# EAGLE design Programmer (EAGLE 7.3.0)
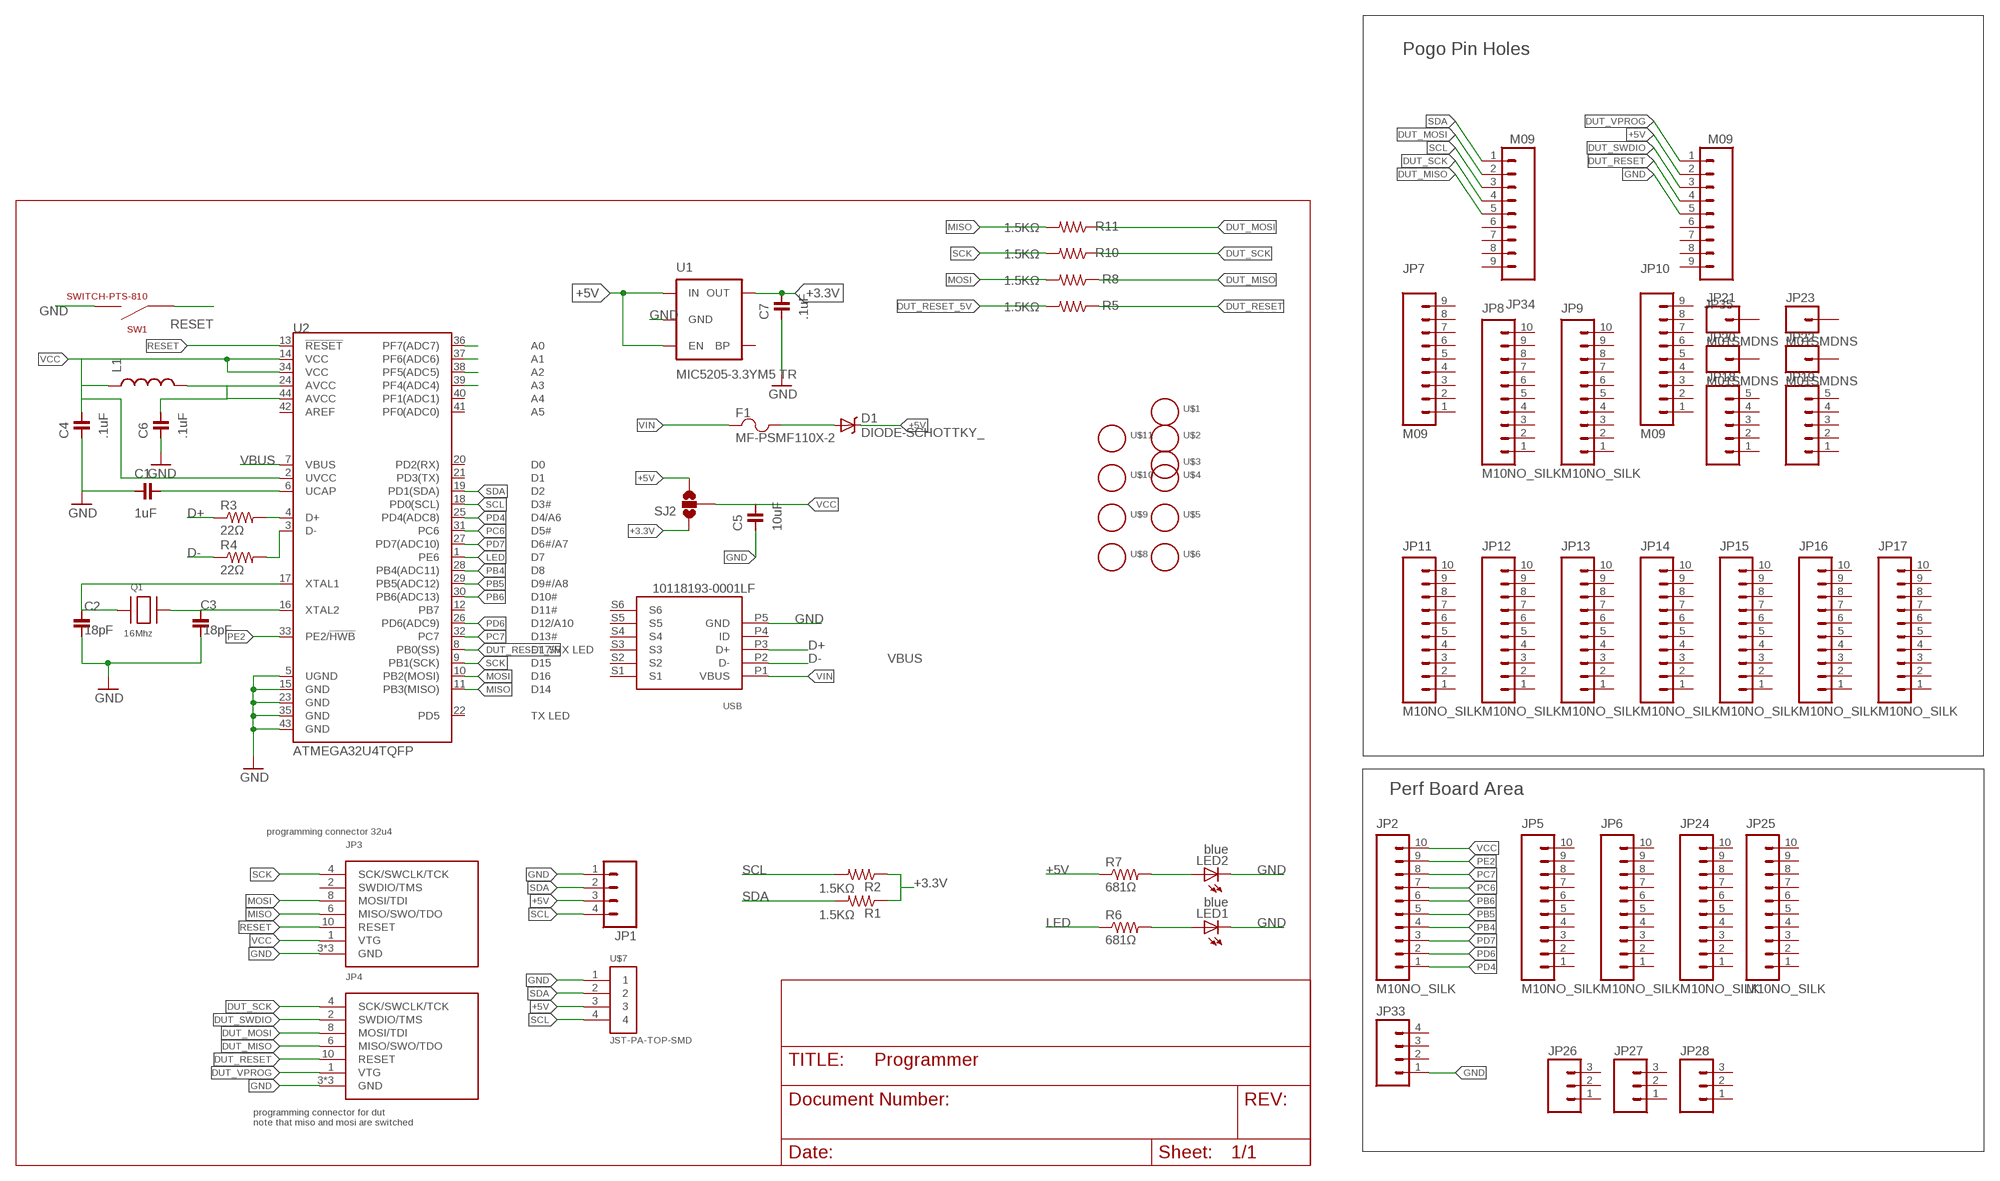
[diagram p0: schematic, sheet 1]

## Parts
C1  1uF  CAPACITOR-1UF  [0603]
C2  18pF  CAPACITOR-18PF  [0603]
C3  18pF  CAPACITOR-18PF  [0603]
C4  .1uF  CAPACITOR-.1UF  [0603]
C5  10uF  CAPACITOR-10UF  [0603]
C6  .1uF  CAPACITOR-.1UF  [0603]
C7  .1uF  CAPACITOR-.1UF  [0603]
D1  DIODE-SCHOTTKY_  [SMA-DIODE]
F1  MF-PSMF110X-2  FUSE  [0805]
JP1  M04LOCK  [1X04_LOCK]
JP2  M10NO_SILK  [1X10_NO_SILK]
JP3  ICSP  [2X5-.05]
JP4  ICSP  [2X5-.05]
JP5  M10NO_SILK  [1X10_NO_SILK]
JP6  M10NO_SILK  [1X10_NO_SILK]
JP7  M09  [1X09]
JP8  M10NO_SILK  [1X10_NO_SILK]
JP9  M10NO_SILK  [1X10_NO_SILK]
JP10  M09  [1X09]
JP11  M10NO_SILK  [1X10_NO_SILK]
JP12  M10NO_SILK  [1X10_NO_SILK]
JP13  M10NO_SILK  [1X10_NO_SILK]
JP14  M10NO_SILK  [1X10_NO_SILK]
JP15  M10NO_SILK  [1X10_NO_SILK]
JP16  M10NO_SILK  [1X10_NO_SILK]
JP17  M10NO_SILK  [1X10_NO_SILK]
JP18  M05NO_SILK  [1X05_NO_SILK]
JP19  M05NO_SILK  [1X05_NO_SILK]
JP20  M01SMDNS  [1X01NS]
JP21  M01SMDNS  [1X01NS]
JP22  M01SMDNS  [1X01NS]
JP23  M01SMDNS  [1X01NS]
JP24  M10NO_SILK  [1X10_NO_SILK]
JP25  M10NO_SILK  [1X10_NO_SILK]
JP26  M031X03_NO_SILK  [1X03_NO_SILK]
JP27  M031X03_NO_SILK  [1X03_NO_SILK]
JP28  M031X03_NO_SILK  [1X03_NO_SILK]
JP33  M041X04_NO_SILK  [1X04_NO_SILK]
JP34  M09  [1X09]
JP35  M09  [1X09]
L1  INDUCTOR0805  [0805]
LED1  blue  LED-0805-BLUE  [0805-LED]
LED2  blue  LED-0805-BLUE  [0805-LED]
Q1  16Mhz  CRYSTAL-NX3225  [NX3225]
R1  1.5KΩ  RESISTOR-1.5KΩ  [0603]
R2  1.5KΩ  RESISTOR-1.5KΩ  [0603]
R3  22Ω  RESISTOR-22Ω  [0603]
R4  22Ω  RESISTOR-22Ω  [0603]
R5  1.5KΩ  RESISTOR-1.5KΩ  [0603]
R6  681Ω  RESISTOR-681Ω  [0603]
R7  681Ω  RESISTOR-681Ω  [0603]
R8  1.5KΩ  RESISTOR-1.5KΩ  [0603]
R10  1.5KΩ  RESISTOR-1.5KΩ  [0603]
R11  1.5KΩ  RESISTOR-1.5KΩ  [0603]
SJ2  SOLDERJUMPER_2WAYPASTE1&2  [SJ_3_PASTE1&2]
SW1  SWITCH-PTS-810  [TACT-SWITCH-PTS-810]
U1  MIC5205-3.3YM5 TR  VREG-MIC5205-3.3V  [SOT23-5]
U2  ATMEGA32U4TQFP  [SPARKFUN-DIGITALIC_TQFP44]
U3  USBFCI-MICROB  [USB-MICROB-FCI]
U$1  HOLE#2  [HOLE-#2]
U$2  HOLE#2  [HOLE-#2]
U$3  HOLE#2  [HOLE-#2]
U$4  HOLE#2  [HOLE-#2]
U$5  HOLE#2  [HOLE-#2]
U$6  HOLE#2  [HOLE-#2]
U$7  JST-PA-TOP-SMD  [JST-PA-TOP-SMD]
U$8  HOLE#2  [HOLE-#2]
U$9  HOLE#2  [HOLE-#2]
U$10  HOLE#2  [HOLE-#2]
U$11  HOLE#2  [HOLE-#2]

## Nets
+3.3V: C7.1 R1.1 R2.1 SJ2.1 U1.5(OUT)
+5V: D1.C JP1.3 JP35.2 R7.1 SJ2.3 U1.1(IN) U1.3(EN) U$7.3
D+: R3.1 U3.P3(D+)
D-: R4.1 U3.P2(D-)
DUT_MISO: JP4.6(MISO/SWO/TDO) JP34.5 R8.1
DUT_MOSI: JP4.8(MOSI/TDI) JP34.2 R11.1
DUT_RESET: JP4.10(RESET) JP35.4 R5.1
DUT_RESET_5V: R5.2 U2.8(PB0(SS))
DUT_SCK: JP4.4(SCK/SWCLK/TCK) JP34.4 R10.1
DUT_SWDIO: JP4.2(SWDIO/TMS) JP35.3
DUT_VPROG: JP4.1(VTG) JP35.1
GND: C1.2 C2.2 C3.2 C4.2 C5.2 C6.2 C7.2 JP1.1 JP3.3(GND) JP3.5(GND) JP3.9(GND) JP4.3(GND) JP4.5(GND) JP4.9(GND) JP33.1 JP35.5 LED1.C LED2.C SW1.P$3(NEG1) SW1.P$4(NEG1) U1.2(GND) U2.5(UGND) U2.15(GND) U2.23(GND) U2.35(GND) U2.43(GND) U3.P5(GND) U$7.1
LED: R6.1 U2.1(PE6)
MISO: JP3.6(MISO/SWO/TDO) R11.2 U2.11(PB3(MISO))
MOSI: JP3.8(MOSI/TDI) R8.2 U2.10(PB2(MOSI))
N$1: C1.1 U2.6(UCAP)
N$2: C6.1 L1.2 U2.24(AVCC) U2.44(AVCC)
N$4: C3.1 Q1.3(X2) U2.16(XTAL2)
N$5: LED1.A R6.2
N$6: U2.39(PF4(ADC4))
N$7: U2.38(PF5(ADC5))
N$8: R3.2 U2.4(D+)
N$9: R4.2 U2.3(D-)
N$10: U2.37(PF6(ADC6))
N$11: U2.36(PF7(ADC7))
N$12: LED2.A R7.2
N$15: C2.1 Q1.1(X1) U2.17(XTAL1)
PB4: JP2.4 U2.28(PB4(ADC11))
PB5: JP2.5 U2.29(PB5(ADC12))
PB6: JP2.6 U2.30(PB6(ADC13))
PC6: JP2.7 U2.31(PC6)
PC7: JP2.8 U2.32(PC7)
PD4: JP2.1 U2.25(PD4(ADC8))
PD6: JP2.2 U2.26(PD6(ADC9))
PD7: JP2.3 U2.27(PD7(ADC10))
PE2: JP2.9 U2.33(PE2/!HWB)
RESET: JP3.10(RESET) SW1.P$1(POS1) SW1.P$2(POS1) U2.13(!RESET)
SCK: JP3.4(SCK/SWCLK/TCK) R10.2 U2.9(PB1(SCK))
SCL: JP1.4 JP34.3 R2.2 U2.18(PD0(SCL)) U$7.4
SDA: JP1.2 JP34.1 R1.2 U2.19(PD1(SDA)) U$7.2
VBUS: D1.A F1.2 U2.7(VBUS)
VCC: C4.1 C5.1 JP2.10 JP3.1(VTG) L1.1 SJ2.2 U2.2(UVCC) U2.14(VCC) U2.34(VCC)
VIN: F1.1 U3.P1(VBUS)
Unconnected: JP3.2(SWDIO/TMS) JP5.1 JP5.2 JP5.3 JP5.4 JP5.5 JP5.6 JP5.7 JP5.8 JP5.9 JP5.10 JP6.1 JP6.2 JP6.3 JP6.4 JP6.5 JP6.6 JP6.7 JP6.8 JP6.9 JP6.10 JP7.1 JP7.2 JP7.3 JP7.4 JP7.5 JP7.6 JP7.7 JP7.8 JP7.9 JP8.1 JP8.2 JP8.3 JP8.4 JP8.5 JP8.6 JP8.7 JP8.8 JP8.9 JP8.10 JP9.1 JP9.2 JP9.3 JP9.4 JP9.5 JP9.6 JP9.7 JP9.8 JP9.9 JP9.10 JP10.1 JP10.2 JP10.3 JP10.4 JP10.5 JP10.6 JP10.7 JP10.8 JP10.9 JP11.1 JP11.2 JP11.3 JP11.4 JP11.5 JP11.6 JP11.7 JP11.8 JP11.9 JP11.10 JP12.1 JP12.2 JP12.3 JP12.4 JP12.5 JP12.6 JP12.7 JP12.8 JP12.9 JP12.10 JP13.1 JP13.2 JP13.3 JP13.4 JP13.5 JP13.6 JP13.7 JP13.8 JP13.9 JP13.10 JP14.1 JP14.2 JP14.3 JP14.4 JP14.5 JP14.6 JP14.7 JP14.8 JP14.9 JP14.10 JP15.1 JP15.2 JP15.3 JP15.4 JP15.5 JP15.6 JP15.7 JP15.8 JP15.9 JP15.10 JP16.1 JP16.2 JP16.3 JP16.4 JP16.5 JP16.6 JP16.7 JP16.8 JP16.9 JP16.10 JP17.1 JP17.2 JP17.3 JP17.4 JP17.5 JP17.6 JP17.7 JP17.8 JP17.9 JP17.10 JP18.1 JP18.2 JP18.3 JP18.4 JP18.5 JP19.1 JP19.2 JP19.3 JP19.4 JP19.5 JP20.1 JP21.1 JP22.1 JP23.1 JP24.1 JP24.2 JP24.3 JP24.4 JP24.5 JP24.6 JP24.7 JP24.8 JP24.9 JP24.10 JP25.1 JP25.2 JP25.3 JP25.4 JP25.5 JP25.6 JP25.7 JP25.8 JP25.9 JP25.10 JP26.1 JP26.2 JP26.3 JP27.1 JP27.2 JP27.3 JP28.1 JP28.2 JP28.3 JP33.2 JP33.3 JP33.4 JP34.6 JP34.7 JP34.8 JP34.9 JP35.6 JP35.7 JP35.8 JP35.9 U1.4(BP) U2.12(PB7) U2.20(PD2(RX)) U2.21(PD3(TX)) U2.22(PD5) U2.40(PF1(ADC1)) U2.41(PF0(ADC0)) U2.42(AREF) U3.P4(ID) U3.S1 U3.S2 U3.S3 U3.S4 U3.S5 U3.S6 U$1.P$1(HOLE) U$2.P$1(HOLE) U$3.P$1(HOLE) U$4.P$1(HOLE) U$5.P$1(HOLE) U$6.P$1(HOLE) U$8.P$1(HOLE) U$9.P$1(HOLE) U$10.P$1(HOLE) U$11.P$1(HOLE)

## Notes on the sheet
- Pogo Pin Holes
- Perf Board Area
- programming connector 32u4
- programming connector for dut
  note that miso and mosi are switched

## Library data of the parts
C1 = Modulo:CAPACITOR: Capacitor; PARTNUM: C0603C105K4RACTU
C2 C3 = Modulo:CAPACITOR: Capacitor; PARTNUM: C0603C180J5GACTU
C4 C6 C7 = Modulo:CAPACITOR: Capacitor; PARTNUM: C0603C104K5RACTU
C5 = Modulo:CAPACITOR: Capacitor; PARTNUM: GRM188R61C106MA73D
D1 = SparkFun-DiscreteSemi:DIODE-SCHOTTKY: Commonly MBRA140.
F1 = Modulo:FUSE; PARTNUM: MF-PSFM110X-2
JP1 JP33 = SparkFun-Connectors:M04: Header 4 Standard 4-pin 0.1" header. Use with straight break away headers (SKU : PRT-00116), right angle break away headers (PRT-00553), swiss pins (PRT-00743), machine pins (PRT-00117), and female headers (PRT-00115). Molex polarized connector foot print use with SKU : PRT-08231 with associated crimp pins and housings. 1MM SMD Version SKU: PRT-10208
JP2 JP5 JP6 JP8 JP9 JP11-JP17 JP24 JP25 = SparkFun-Connectors:M10: Header 10 Standard 10-pin 0.1" header. Use with straight break away headers (SKU : PRT-00116), right angle break away headers (PRT-00553), swiss pins (PRT-00743), machine pins (PRT-00117), and female headers (PRT-00115).
JP3 JP4 = Modulo:ICSP
JP7 JP10 JP34 JP35 = SparkFun-Connectors:M09: Header 9 Standard 9-pin 0.1" header. Use with straight break away headers (SKU : PRT-00116), right angle break away headers (PRT-00553), swiss pins (PRT-00743), machine pins (PRT-00117), and female headers (PRT-00115).
JP18 JP19 = SparkFun-Connectors:M05: Header 5 Standard 5-pin 0.1" header. Use with straight break away headers (SKU : PRT-00116), right angle break away headers (PRT-00553), swiss pins (PRT-00743), machine pins (PRT-00117), and female headers (PRT-00115). Molex polarized connector foot print use with SKU : PRT-08230 with associated crimp pins and housings.
JP20-JP23 = SparkFun-Connectors:M01: Header 1 Standard 1-pin 0.1" header. Use with straight break away headers (SKU : PRT-00116), right angle break away headers (PRT-00553), swiss pins (PRT-00743), machine pins (PRT-00117), and female headers (PRT-00115).
JP26-JP28 = SparkFun-Connectors:M03: Header 3 Standard 3-pin 0.1" header. Use with straight break away headers (SKU : PRT-00116), right angle break away headers (PRT-00553), swiss pins (PRT-00743), machine pins (PRT-00117), and female headers (PRT-00115). Molex polarized connector foot print use with SKU : PRT-08232 with associated crimp pins and housings.
L1 = IntegerLabs:INDUCTOR: Inductors Basic Inductor/Choke - 0603 and 1206. Footprints are not proven and vary greatly between part numbers. SRN6045- 33uH, 20% 1.4A SDR0403-560KL - 56uH, 10%, 500mA RMS/740mA peak
LED1 LED2 = Modulo:LED: LED; PARTNUM: LTST-C171TBKT
Q1 = Modulo:CRYSTAL; PARTNUM: CX3225GB16000D0HEQCC
R1 R2 R5 R8 R10 R11 = Modulo:RESISTOR: Resistor Basic schematic elements and footprints for 0603, 1206, and PTH resistors.; PARTNUM: ERJ-3EKF1501V
R3 R4 = Modulo:RESISTOR: Resistor Basic schematic elements and footprints for 0603, 1206, and PTH resistors.; PARTNUM: ERJ-3EKF22R0V
R6 R7 = Modulo:RESISTOR: Resistor Basic schematic elements and footprints for 0603, 1206, and PTH resistors.; PARTNUM: ERJ-3EKF6810V
SJ2 = SparkFun-Passives:SOLDERJUMPER_2WAY: Solder Jumper 2 way solder jumper
SW1 = Modulo:SWITCH; PARTNUM: PTS810 SJM 250 SMTR LFS
U1 = Modulo:VREG-MIC5205: V_REG MIC5219 Standard 3.3V and 5V 150mA LDO voltage regulator in SOT-23 layout. Micrel part MIC5205. BP (by-pass) pin is used to lower output noise with 470pF cap, may be left open.; PARTNUM: MIC5205-3.3YM5 TR
U2 = SparkFun-DigitalIC:ATMEGA32U4: Atmel 44-pin 8-bit Microcontroller with 32KBytes of ISP Flash and USB Controller ----- Please use the QFN-44-NOPAD_1:1 package for the footprint of all boards using a 32U4. Route traces directly away from the pads as much as possible.; PARTNUM: ATMEGA32U4TQFP; PROD_ID: IC-11161
U3 = IntegerLabs:USB; PARTNUM: 10118193-0001LF
U$1-U$6 U$8-U$11 = Modulo:HOLE; PARTNUM: EXCLUDE
U$7 = Modulo:JST-PA; PARTNUM: SM04B-PASS-TBT(LF)(SN)

## Board
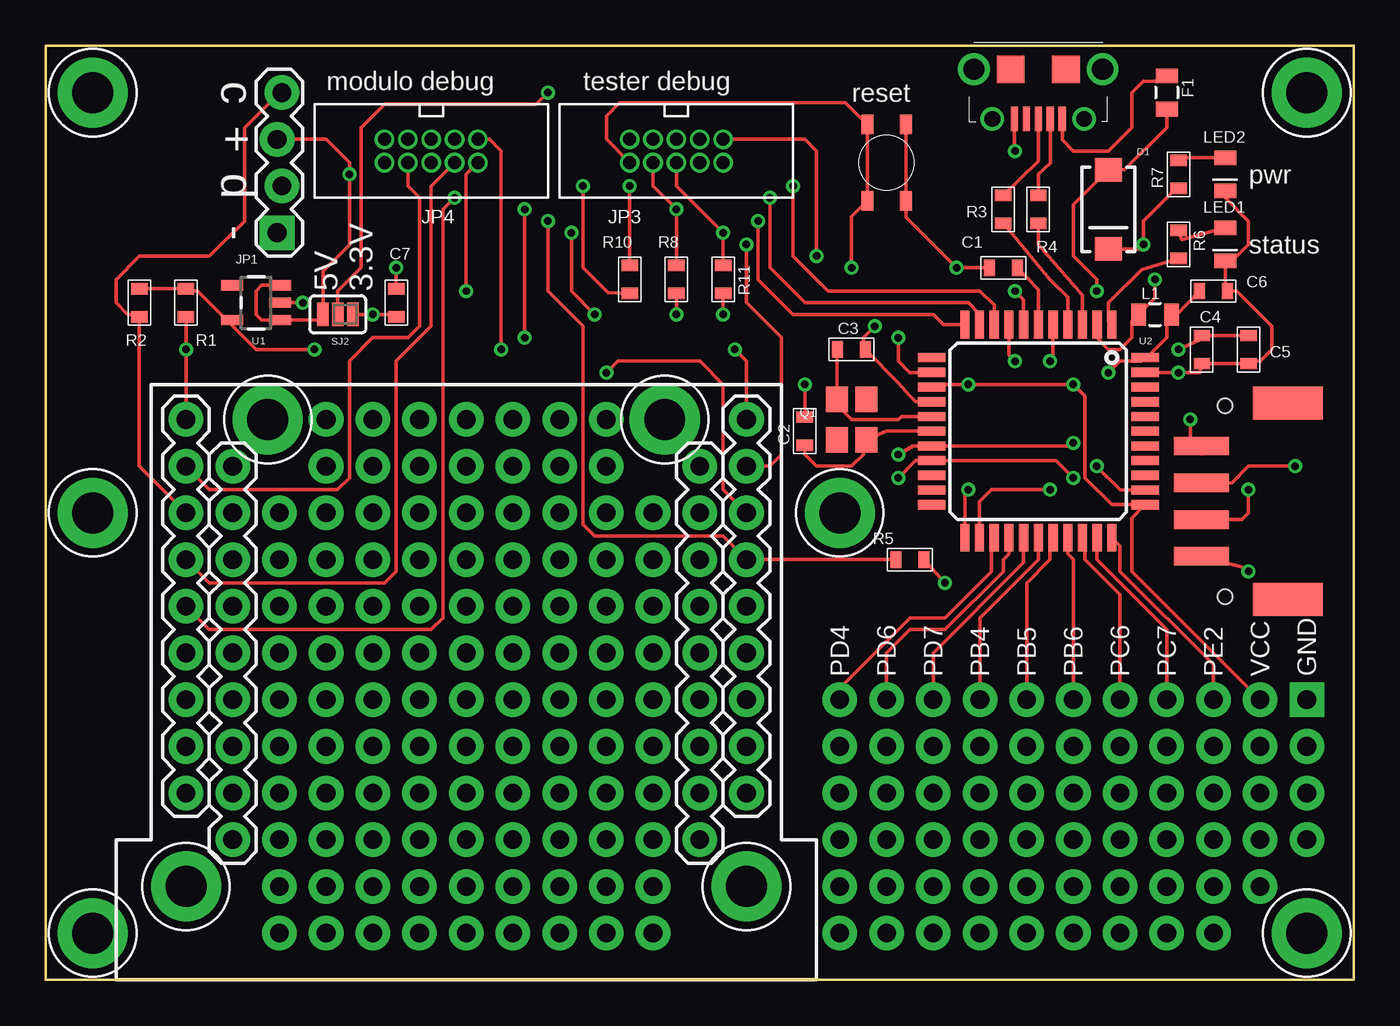
[diagram p1: board, top side]
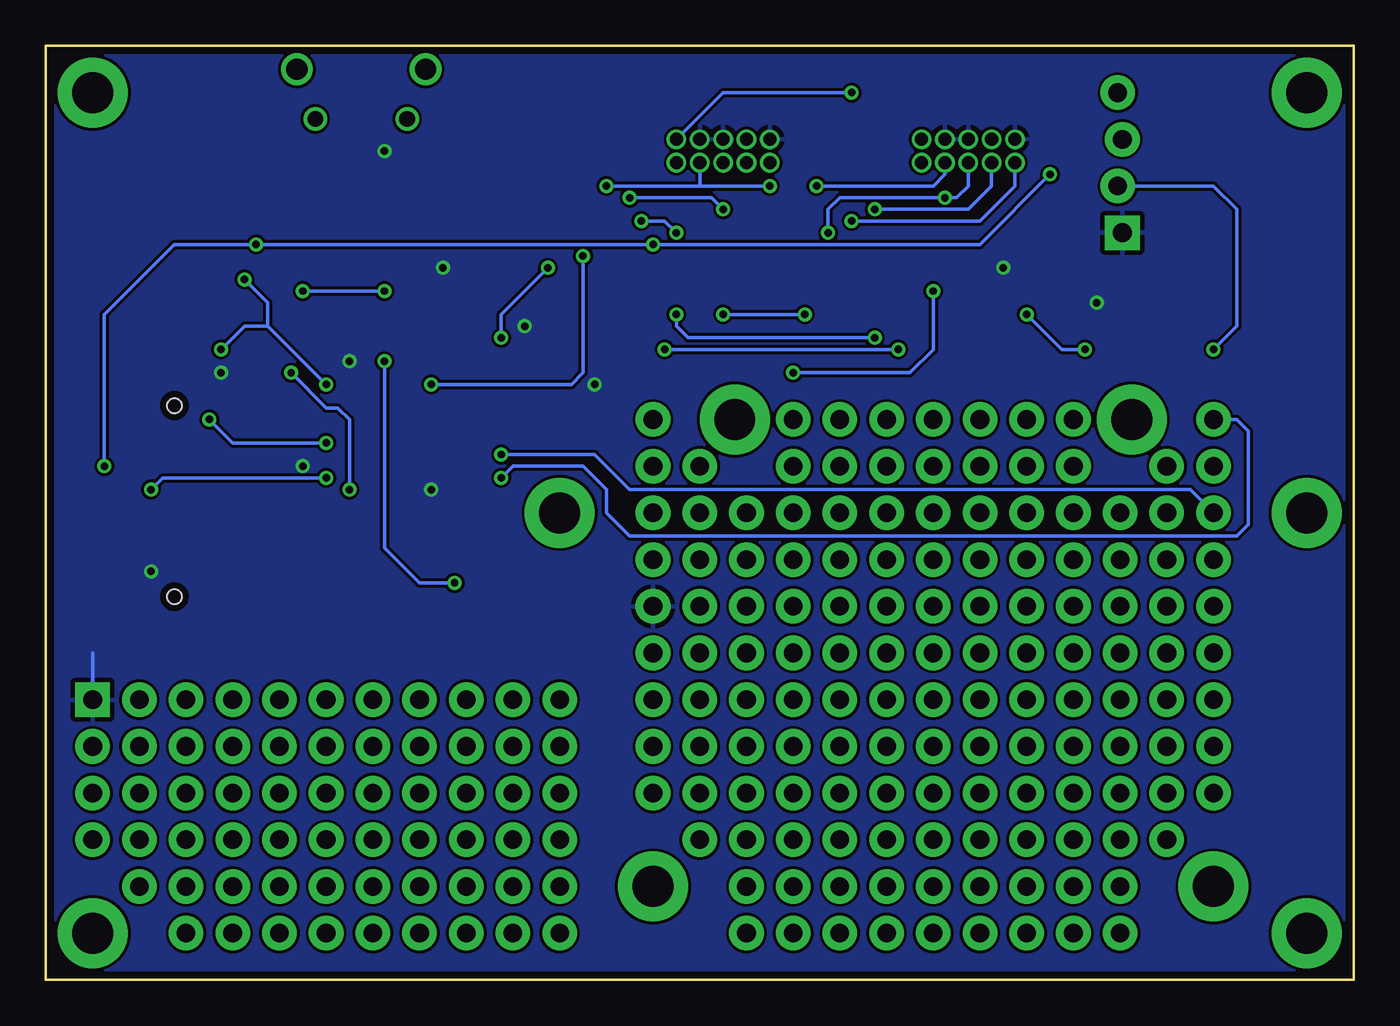
[diagram p2: board, bottom side, seen from below]

Size 71.12 x 50.8 mm. Coordinates in mm from the lower left corner, seen from the top.
Outline: 0,0 0,50.8 71.12,50.8 71.12,0 0,0
Copper layers (1*16): Top 0.0356mm / dielectric 1.5011mm / Bottom 0.0356mm
Design rules "LaenPCBOrder": minimum track width 6mil, minimum drill 13mil, track to track 6mil, track to pad 6mil, pad to pad 6mil, via to via 6mil, smd to smd 6mil, copper to edge 15mil, drill to drill 6mil, minimum pad ring 7mil, minimum via ring 7mil, stop-mask expansion 3mil, vias tented up to drill 0mil, thermal gap 10mil

### Footprints (pad centres in the part's own frame; a part is rotated, then mirrored left to right if it is on the bottom)
0603 = smd 0.61 x 0.889: 1 -0.762,0; 2 0.762,0
SMA-DIODE = smd 1.27 x 1.47: A -2.15,0; C 2.15,0
0805 = smd 0.8 x 1.2: 1 -0.9,0; 2 0.9,0
1X04_LOCK = drill 1.016 pad 1.88 square: 1 0,0.127 | drill 1.016 pad 1.88: 2 2.54,-0.127; 3 5.08,0.127; 4 7.62,-0.127
1X10_NO_SILK = drill 1.016 pad 1.88: 1 0,0; 2 2.54,0; 3 5.08,0; 4 7.62,0; 5 10.16,0; 6 12.7,0; 7 15.24,0; 8 17.78,0; 9 20.32,0; 10 22.86,0
2X5-.05 = drill 0.711 pad 1.016: 1 -2.54,-1.27; 2 -2.54,0; 3 -1.27,-1.27; 4 -1.27,0; 5 0,-1.27; 6 0,0; 7 1.27,-1.27; 8 1.27,0; 9 2.54,-1.27; 10 2.54,0
1X09 = drill 1.016 pad 1.88: 1 0,0; 2 2.54,0; 3 5.08,0; 4 7.62,0; 5 10.16,0; 6 12.7,0; 7 15.24,0; 8 17.78,0; 9 20.32,0
1X05_NO_SILK = drill 1.016 pad 1.88: 1 0,0; 2 2.54,0; 3 5.08,0; 4 7.62,0; 5 10.16,0
1X01NS = drill 1.016 pad 1.88: 1 0,0
1X03_NO_SILK = drill 1.016 pad 1.88: 1 0,0; 2 2.54,0; 3 5.08,0
1X04_NO_SILK = drill 1.016 pad 1.88 square: 1 0,0 | drill 1.016 pad 1.88: 2 2.54,0; 3 5.08,0; 4 7.62,0
0805-LED = smd 1.2 x 0.8: A 0,-0.9; C 0,0.9
NX3225 = smd 1.4 x 1.2: 1 -1.1,-0.8; 2 1.1,-0.8; 3 1.1,0.8; 4 -1.1,0.8
SJ_3_PASTE1&2 = smd 0.635 x 1.27: 1 -0.813,0; 2 0,0; 3 0.813,0
TACT-SWITCH-PTS-810 = smd 1.05 x 0.65: P$1 -2.075,1.05; P$2 2.075,1.05; P$3 -2.075,-1.05; P$4 2.075,-1.05
SOT23-5 = smd 0.55 x 1.2: 1 -0.95,-1.3; 2 0,-1.3; 3 0.95,-1.3; 4 0.95,1.3; 5 -0.95,1.3
SPARKFUN-DIGITALIC_TQFP44 = smd 1.5 x 0.5: 1 -5.8,4; 2 -5.8,3.2; 3 -5.8,2.4; 4 -5.8,1.6; 5 -5.8,0.8; 6 -5.8,0; 7 -5.8,-0.8; 8 -5.8,-1.6; 9 -5.8,-2.4; 10 -5.8,-3.2; 11 -5.8,-4; 23 5.8,-4; 24 5.8,-3.2; 25 5.8,-2.4; 26 5.8,-1.6; 27 5.8,-0.8; 28 5.8,0; 29 5.8,0.8; 30 5.8,1.6; 31 5.8,2.4; 32 5.8,3.2; 33 5.8,4 | smd 0.5 x 1.5: 12 -4,-5.8; 13 -3.2,-5.8; 14 -2.4,-5.8; 15 -1.6,-5.8; 16 -0.8,-5.8; 17 0,-5.8; 18 0.8,-5.8; 19 1.6,-5.8; 20 2.4,-5.8; 21 3.2,-5.8; 22 4,-5.8; 34 4,5.8; 35 3.2,5.8; 36 2.4,5.8; 37 1.6,5.8; 38 0.8,5.8; 39 0,5.8; 40 -0.8,5.8; 41 -1.6,5.8; 42 -2.4,5.8; 43 -3.2,5.8; 44 -4,5.8
USB-MICROB-FCI = smd 0.4 x 1.35: P1 -1.3,2.7; P2 -0.65,2.7; P3 0,2.7; P4 0.65,2.7; P5 1.3,2.7 | drill 0.85: S1 -2.5,2.7; S2 2.5,2.7 | drill 1.15: S3 -3.5,0; S6 3.5,0 | smd 1.5 x 1.5: S4 -1.5,0; S5 1.5,0
HOLE-#2 = drill 2.223 pad 3.81: P$1 0,0
JST-PA-TOP-SMD = smd 1 x 3: 1 -3,1.3; 2 -1,1.3; 3 1,1.3; 4 3,1.3 | smd 1.8 x 3.8: R1 -5.35,-3.4; R2 5.35,-3.4 | hole 0.8: 5.2,0; -5.2,0

### Placement (x,y rotation side)
C1  52.07,38.73 180 top
C2  41.27,29.85 90 top
C3  43.81,34.29 0 top
C4  62.86,34.29 270 top
C5  65.41,34.29 270 top
C6  63.5,37.47 0 top
C7  19.05,36.83 90 top
D1  57.78,41.91 270 top
F1  60.96,48.26 270 top
JP1  12.7,40.64 90 top
JP2  43.18,15.24 0 top
JP3  34.29,44.45 180 top
JP4  20.95,44.45 180 top
JP5  43.18,12.7 0 top
JP6  43.18,10.16 0 top
JP7  10.16,7.62 90 top
JP8  12.7,2.54 90 top
JP9  33.02,2.54 90 top
JP10  35.56,7.62 90 top
JP11  17.78,2.54 90 top
JP12  20.32,2.54 90 top
JP13  22.86,2.54 90 top
JP14  15.24,2.54 90 top
JP15  25.4,2.54 90 top
JP16  27.94,2.54 90 top
JP17  30.48,2.54 90 top
JP18  15.24,27.94 0 top
JP19  15.24,30.48 0 top
JP20  27.94,30.48 0 top
JP21  27.94,27.94 0 top
JP22  30.48,30.48 0 top
JP23  30.48,27.94 0 top
JP24  43.18,7.62 0 top
JP25  43.18,5.08 0 top
JP26  43.18,2.54 0 top
JP27  50.8,2.54 0 top
JP28  58.42,2.54 0 top
JP33  68.58,15.24 270 top
JP34  7.62,30.48 270 top
JP35  38.1,30.48 270 top
L1  60.33,36.2 0 top
LED1  64.13,40.01 180 top
LED2  64.13,43.82 180 top
Q1  43.81,30.48 90 top
R1  7.62,36.83 270 top
R2  5.08,36.83 270 top
R3  52.07,41.91 270 top
R4  53.97,41.91 270 top
R5  46.99,22.86 0 top
R6  61.59,40.01 90 top
R7  61.59,43.82 90 top
R8  34.29,38.1 90 top
R10  31.75,38.1 90 top
R11  36.83,38.1 90 top
SJ2  15.88,36.2 180 top
SW1  45.72,44.45 90 top
U1  11.43,36.83 90 top
U2  53.97,29.85 270 top
U3  53.97,49.53 180 top
U$1  7.62,5.08 0 top
U$2  38.1,5.08 0 top
U$3  12.06,30.48 0 top
U$4  33.66,30.48 0 top
U$5  2.54,25.4 90 top
U$6  43.18,25.4 90 top
U$7  64.13,26.04 90 top
U$8  2.54,2.54 0 top
U$9  68.58,2.54 0 top
U$10  2.54,48.26 0 top
U$11  68.58,48.26 0 top

### Tracks (layer width: path | path; a pad name or v marks a point on that pad's centre or on a via)
+3.3V  (via drill 0.41)
  Top 0.203: R2.1 R1.1 7.71,37.47 8.25,37.47 9.84,35.88 U1.5 10.13,35.59 11.43,34.29 v14.6,34.29 | SJ2.1 v17.78,36.2 18.96,36.2 C7.1
  Bottom 0.203: v14.6,34.29 15.88,34.29 v17.78,36.2
+5V  (via drill 0.41)
  Top 0.203: U1.3 11.74,37.78 11.43,37.47 11.43,36.2 11.74,35.88 U1.1 14.75,35.88 SJ2.3 15.06,38.56 16.51,40.01 v16.51,43.82 16.51,44.45 15.24,45.72 JP1.3 | U$7.3 64.5,27.04 65.41,27.94 v67.94,27.94 | D1.C 59.44,39.76 v59.69,40.01 59.69,41.28 61.5,43.09 R7.1 | JP35.2 39.37,27.94 40,28.57 40,34.93 38.1,36.83 v38.1,40.01
  Bottom 0.203: v67.94,27.94 67.94,36.2 64.13,40.01 v59.69,40.01 v38.1,40.01 20.32,40.01 v16.51,43.82
D+
  Top 0.203: U3.P3 53.97,44.54 R3.1
D-
  Top 0.203: U3.P2 54.62,44.44 53.97,43.82 R4.1
DUT_MISO  (via drill 0.41)
  Top 0.203: R8.1 v34.29,36.2 | v29.84,36.2 28.58,37.47 v28.58,40.64 | JP34.5 8.89,19.05 20.95,19.05 21.59,19.68 21.59,41.91 v22.22,42.55
  Bottom 0.203: v29.84,36.2 v34.29,36.2 | v28.58,40.64 28.58,41.91 27.94,42.55 v22.22,42.55 21.59,42.55 20.95,43.18 JP4.6
DUT_MOSI  (via drill 0.41)
  Top 0.203: R11.1 v36.83,36.2 | v26.03,41.91 v26.03,34.93 | JP34.2 8.89,26.67 15.88,26.67 16.51,27.3 16.51,33.66 17.78,34.93 19.68,34.93 20.32,35.56 20.32,42.55 19.68,43.18 JP4.8
  Bottom 0.203: v36.83,36.2 36.83,35.56 36.19,34.93 v26.03,34.93 | v26.03,41.91 20.95,41.91 19.68,43.18 JP4.8
DUT_RESET  (via drill 0.41)
  Top 0.203: v27.3,41.28 27.3,37.47 29.21,35.56 29.21,24.76 29.84,24.13 36.83,24.13 JP35.4 R5.1 46.36,22.86
  Bottom 0.203: v27.3,41.28 20.32,41.28 18.41,43.18 JP4.10
DUT_RESET_5V  (via drill 0.41)
  Top 0.203: U2.8 52.38,33.98 v52.7,33.66 | R5.2 v48.89,21.59
  Bottom 0.203: v52.7,33.66 52.7,23.49 50.8,21.59 v48.89,21.59
DUT_SCK  (via drill 0.41)
  Top 0.203: R10.1 30.57,37.38 29.21,38.73 v29.21,43.18 | JP34.4 8.89,21.59 18.41,21.59 19.05,22.22 19.05,33.66 20.95,35.56 20.95,43.18 JP4.4
  Bottom 0.203: v29.21,43.18 22.86,43.18 22.22,43.82 JP4.4
DUT_SWDIO  (via drill 0.41)
  Top 0.203: JP35.3 36.83,26.67 36.83,32.39 35.56,33.66 31.11,33.66 v30.48,33.02 | v22.86,37.47 22.86,43.82 JP4.2
  Bottom 0.203: v30.48,33.02 24.13,33.02 22.86,34.29 v22.86,37.47
DUT_VPROG  (via drill 0.41)
  Top 0.203: v24.77,34.29 24.77,45.09 24.13,45.72 JP4.1 | JP35.1 38.1,33.66 v37.47,34.29
  Bottom 0.203: v37.47,34.29 v24.77,34.29
GND  (via drill 0.41)
  Top 0.203: U2.15 47.3,31.44 46.99,31.75 46.36,32.48 C3.2 44.45,34.38 44.45,34.93 v45.08,35.56 | U2.35 58.44,26.64 58.42,26.67 57.12,27.91 v57.15,27.94 | v61.59,33.02 61.57,33.05 U2.43 62.75,33.05 C4.2 C5.2 65.5,33.66 66.04,33.66 66.67,34.29 66.67,35.56 64.77,37.47 C6.2 64.13,37.55 LED1.C 64.4,39.37 64.77,39.37 65.41,40.01 65.41,41.28 64.13,42.55 LED2.C | U2.5 54.77,33.82 v54.61,33.66 | C1.2 v49.53,38.73 46.77,41.5 SW1.P$3 SW1.P$4 | U3.P5 52.67,45.12 v52.7,45.09 | C7.2 v19.05,38.73 | U1.2 v13.97,36.83 | U$7.1 65.23,22.4 v65.41,22.22 | U2.23 49.97,26.48 v50.16,26.67 | C2.2 v41.27,32.39
  Bottom 0.203: JP33.1 68.58,17.78
  pour Bottom: 0,0 0,50.8 71.12,52.07 71.12,0
LED
  Top 0.203: R6.1 59.6,38.65 57.78,36.83 57.78,35.84 U2.1
MISO  (via drill 0.41)
  Top 0.203: U2.11 48.81,35.65 48.26,36.2 40.64,36.2 38.73,38.1 v38.73,41.28 | R11.2 v36.83,40.64 34.29,43.18 JP3.6
  Bottom 0.203: v38.73,41.28 37.47,41.28 v36.83,40.64
MOSI  (via drill 0.41)
  Top 0.203: U2.10 50.77,36.22 50.16,36.83 41.27,36.83 39.37,38.73 v39.37,42.55 | R8.2 v34.29,41.91 33.02,43.18 JP3.8
  Bottom 0.203: v39.37,42.55 34.92,42.55 v34.29,41.91
N$1
  Top 0.203: U2.6 53.97,37.55 C1.1
N$2  (via drill 0.41)
  Top 0.203: C6.1 61.5,36.2 L1.2 60.96,35.93 60.96,34.93 59.88,33.85 U2.44 59.58,33.66 58.42,33.66 v57.78,33.02 | U2.24 50.77,26.01 51.44,26.67 v54.61,26.67
  Bottom 0.203: v54.61,26.67 54.61,30.48 55.25,31.11 55.88,31.11 v57.78,33.02
N$4
  Top 0.203: U2.16 46.52,30.64 46.36,30.48 43.81,30.48 43.18,31.11 43.18,31.41 Q1.3 43.02,34.22 C3.1
N$5
  Top 0.203: LED1.A 61.77,40.27 R6.2
N$8
  Top 0.203: U2.4 55.58,37.14 54.61,38.1 R3.2
N$9
  Top 0.203: U2.3 56.38,37.23 53.97,40.01 R4.2
N$12
  Top 0.203: LED2.A 61.77,44.72 R7.2
N$15
  Top 0.203: U2.17 45.72,29.85 Q1.1 | 45.08,28.91 Q1.1 | C2.1 41.27,28.57 41.91,27.94 43.81,27.94 44.45,28.57 44.45,29.21 Q1.1
PB4
  Top 0.203: JP2.4 50.8,19.68 53.97,22.86 U2.28
PB5
  Top 0.203: JP2.5 53.34,21.59 54.61,22.86 54.61,23.88 U2.29
PB6
  Top 0.203: JP2.6 55.88,22.86 55.58,23.16 U2.30
PC6
  Top 0.203: JP2.7 58.42,20.95 56.52,22.86 56.52,23.9 U2.31
PC7
  Top 0.203: JP2.8 60.96,19.05 57.15,22.86 57.15,24.02 U2.32
PD4
  Top 0.203: JP2.1 43.18,15.88 46.99,19.68 48.89,19.68 51.44,22.22 51.44,23.9 U2.25
PD6
  Top 0.203: U2.26 52.38,23.16 52.07,22.86 52.07,22.22 48.89,19.05 46.99,19.05 45.72,17.78 JP2.2
PD7
  Top 0.203: U2.27 53.17,22.7 48.26,17.78 JP2.3
PE2
  Top 0.203: JP2.9 63.5,17.14 58.42,22.22 58.42,23.6 U2.33
RESET  (via drill 0.41)
  Top 0.203: U2.13 46.97,33.05 46.36,33.66 v46.36,34.93 | v43.81,38.73 43.81,41.52 SW1.P$1 SW1.P$2 43.5,47.7 31.19,47.7 30.48,46.99 30.48,45.72 JP3.10
  Bottom 0.203: v46.36,34.93 46.36,36.2 v43.81,38.73
SCK  (via drill 0.41)
  Top 0.203: U2.9 51.58,36.69 50.8,37.47 42.55,37.47 40.64,39.37 v40.64,43.18 | R10.2 v31.75,43.18
  Bottom 0.203: v40.64,43.18 35.56,43.18 | 35.56,43.18 JP3.4 | v31.75,43.18 35.56,43.18
SCL  (via drill 0.41)
  Top 0.203: v46.36,28.57 47.16,29.04 U2.18 55.72,29.04 v55.88,29.21 | U$7.4 62.83,28.61 62.23,29.21 v62.23,30.48 | JP1.4 12.7,48.26 10.79,46.36 10.79,41.28 8.89,39.37 5.08,39.37 3.81,38.1 3.81,36.83 4.45,36.2 4.99,36.2 R2.2 5.08,27.94 JP34.3
  Bottom 0.203: v46.36,28.57 41.27,28.57 39.37,26.67 8.89,26.67 JP34.3 | v55.88,29.21 60.96,29.21 v62.23,30.48
SDA  (via drill 0.41)
  Top 0.203: v46.36,27.3 47.3,28.25 U2.19 54.94,28.25 v55.88,27.3 | R1.2 v7.62,34.29 JP34.1 | U$7.2 65.04,25.04 65.41,25.4 v65.41,26.67
  Bottom 0.203: v46.36,27.3 45.72,27.94 41.91,27.94 40.64,26.67 40.64,25.4 39.37,24.13 6.35,24.13 5.71,24.76 5.71,29.85 6.35,30.48 JP34.1 | JP1.2 7.62,43.18 6.35,41.91 6.35,35.56 v7.62,34.29 | v55.88,27.3 64.77,27.3 v65.41,26.67
VBUS  (via drill 0.41)
  Top 0.203: U2.7 53.17,37 v52.7,37.47 | v57.15,37.47 57.15,38.1 55.88,39.37 55.88,42.16 D1.A 58.66,44.06 60.96,46.36 F1.2
  Bottom 0.203: v52.7,37.47 v57.15,37.47
VCC  (via drill 0.41)
  Top 0.203: C5.1 C4.1 62.77,34.93 62.77,34.84 v61.59,34.29 | U2.2 57.17,34.9 57.78,34.29 58.42,34.29 59.05,34.93 59.05,35.83 L1.1 60.33,37.1 v60.33,38.1 | U2.14 48.31,32.39 v50.16,32.39 v55.88,32.39 56.52,31.75 56.52,27.3 57.97,25.85 U2.34 59.05,25.12 59.05,22.22 JP2.10 | JP3.1 41.27,45.72 41.91,45.09 v41.91,39.37 | SJ2.2 15.88,37.47 17.14,38.73 17.14,46.36 18.41,47.62 26.67,47.62 v27.3,48.26
  Bottom 0.203: v61.59,34.29 60.33,35.56 59.05,35.56 | 59.05,35.56 v55.88,32.39 | v41.91,39.37 41.91,33.02 42.55,32.39 v50.16,32.39 | v27.3,48.26 34.29,48.26 JP3.1 | 59.05,35.56 59.05,36.83 v60.33,38.1
VIN
  Top 0.203: U3.P1 55.27,45.69 55.88,45.09 57.78,45.09 59.05,46.36 59.05,48.26 59.69,48.9 60.69,48.9 F1.1

### Text on the board
tPlace: modulo debug | tester debug | c | reset | + | d | pwr | - | status | 5V | 3.3V | PD4 | PD6 | PD7 | PB4 | PB5 | PB6 | PC6 | PC7 | PE2 | VCC | GND